# Altium schematic sheet Digital.SchDoc
size A4; SheetNumber: 2; SheetTotal: 3
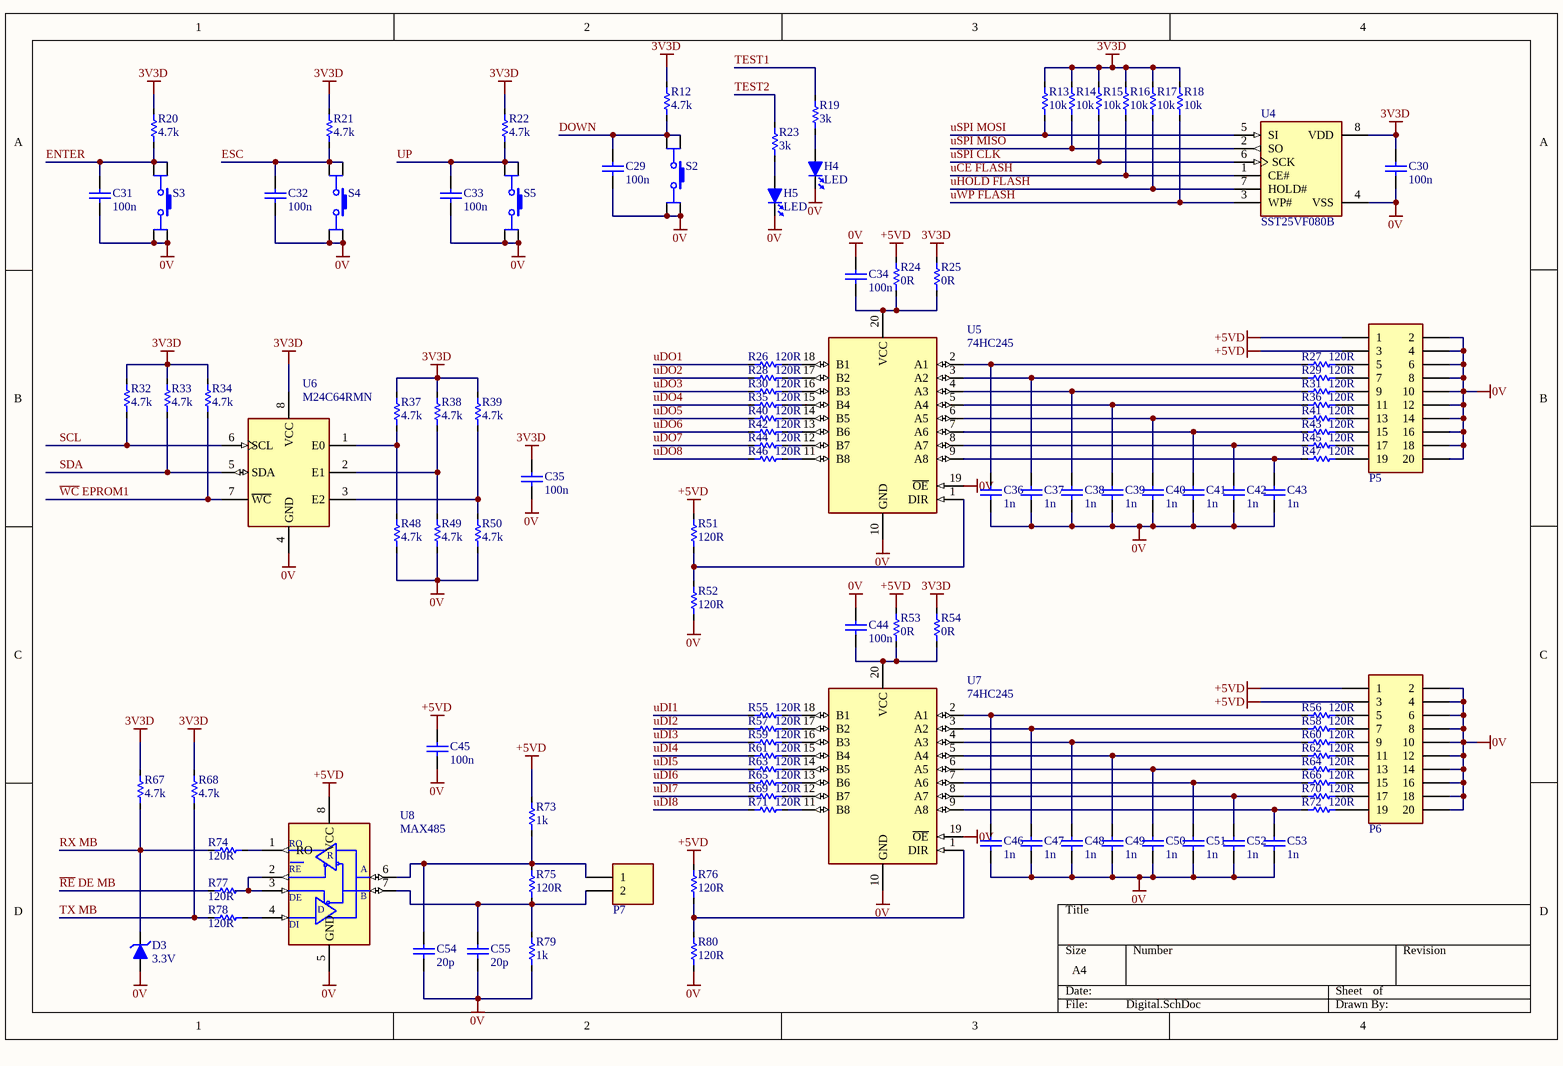
[diagram p0: Digital.SchDoc]

## Parts
C29  100n  [CC3216-1206L]
C30  100n  [CC3216-1206L]
C31  100n  [CC3216-1206L]
C32  100n  [CC3216-1206L]
C33  100n  [CC3216-1206L]
C34  100n  [CC3216-1206L]
C35  100n  [CC3216-1206L]
C36  1n  [CC3216-1206L]
C37  1n  [CC3216-1206L]
C38  1n  [CC3216-1206L]
C39  1n  [CC3216-1206L]
C40  1n  [CC3216-1206L]
C41  1n  [CC3216-1206L]
C42  1n  [CC3216-1206L]
C43  1n  [CC3216-1206L]
C44  100n  [CC3216-1206L]
C45  100n  [CC3216-1206L]
C46  1n  [CC3216-1206L]
C47  1n  [CC3216-1206L]
C48  1n  [CC3216-1206L]
C49  1n  [CC3216-1206L]
C50  1n  [CC3216-1206L]
C51  1n  [CC3216-1206L]
C52  1n  [CC3216-1206L]
C53  1n  [CC3216-1206L]
C54  20p  [CC3216-1206L]
C55  20p  [CC3216-1206L]
D3  3.3V  [SOD123]
H4  LED  [LED1206]
H5  LED  [LED1206]
P5  CONNECTOR, 2x10, 20P  [HDR_MALE_2X10_20P_2.54MM_180]  (value not drawn)
P6  CONNECTOR, 2x10, 20P  [HDR_MALE_2X10_20P_2.54MM_180]  (value not drawn)
P7  CONNECTOR, 1x2, 2P  [DS1070-2MVV6]  (value not drawn)
R12  4.7k  [CR3216-1206l]
R13  10k  [CR3216-1206l]
R14  10k  [CR3216-1206l]
R15  10k  [CR3216-1206l]
R16  10k  [CR3216-1206l]
R17  10k  [CR3216-1206l]
R18  10k  [CR3216-1206l]
R19  3k  [CR3216-1206l]
R20  4.7k  [CR3216-1206l]
R21  4.7k  [CR3216-1206l]
R22  4.7k  [CR3216-1206l]
R23  3k  [CR3216-1206l]
R24  0R  [CR3216-1206l]
R25  0R  [CR3216-1206l]
R26  120R  [CR3216-1206l]
R27  120R  [CR3216-1206l]
R28  120R  [CR3216-1206l]
R29  120R  [CR3216-1206l]
R30  120R  [CR3216-1206l]
R31  120R  [CR3216-1206l]
R32  4.7k  [CR3216-1206l]
R33  4.7k  [CR3216-1206l]
R34  4.7k  [CR3216-1206l]
R35  120R  [CR3216-1206l]
R36  120R  [CR3216-1206l]
R37  4.7k  [CR3216-1206l]
R38  4.7k  [CR3216-1206l]
R39  4.7k  [CR3216-1206l]
R40  120R  [CR3216-1206l]
R41  120R  [CR3216-1206l]
R42  120R  [CR3216-1206l]
R43  120R  [CR3216-1206l]
R44  120R  [CR3216-1206l]
R45  120R  [CR3216-1206l]
R46  120R  [CR3216-1206l]
R47  120R  [CR3216-1206l]
R48  4.7k  [CR3216-1206l]
R49  4.7k  [CR3216-1206l]
R50  4.7k  [CR3216-1206l]
R51  120R  [CR3216-1206l]
R52  120R  [CR3216-1206l]
R53  0R  [CR3216-1206l]
R54  0R  [CR3216-1206l]
R55  120R  [CR3216-1206l]
R56  120R  [CR3216-1206l]
R57  120R  [CR3216-1206l]
R58  120R  [CR3216-1206l]
R59  120R  [CR3216-1206l]
R60  120R  [CR3216-1206l]
R61  120R  [CR3216-1206l]
R62  120R  [CR3216-1206l]
R63  120R  [CR3216-1206l]
R64  120R  [CR3216-1206l]
R65  120R  [CR3216-1206l]
R66  120R  [CR3216-1206l]
R67  4.7k  [CR3216-1206l]
R68  4.7k  [CR3216-1206l]
R69  120R  [CR3216-1206l]
R70  120R  [CR3216-1206l]
R71  120R  [CR3216-1206l]
R72  120R  [CR3216-1206l]
R73  1k  [CR3216-1206l]
R74  120R  [CR3216-1206l]
R75  120R  [CR3216-1206l]
R76  120R  [CR3216-1206l]
R77  120R  [CR3216-1206l]
R78  120R  [CR3216-1206l]
R79  1k  [CR3216-1206l]
R80  120R  [CR3216-1206l]
S2  SWITCH TACT  [SWITCH TACTILE SMD 6x6 4.3mm]  (value not drawn)
S3  SWITCH TACT  [SWITCH TACTILE SMD 6x6 4.3mm]  (value not drawn)
S4  SWITCH TACT  [SWITCH TACTILE SMD 6x6 4.3mm]  (value not drawn)
S5  SWITCH TACT  [SWITCH TACTILE SMD 6x6 4.3mm]  (value not drawn)
U4  SST25VF080B  [SOIC08-S2A]
U5  74HC245  [SOIC127P1030X265-20M]
U6  M24C64RMN  [SOIC127P600X175-8N]
U7  74HC245  [SOIC127P1030X265-20M]
U8  MAX485  [SOIC127P600X175-8N]

## Nets
0V: C29.2 C30.2 C31.2 C32.2 C33.2 C34.1 C35.2 C36.2 C37.2 C38.2 C39.2 C40.2 C41.2 C42.2 C43.2 C44.1 C45.2 C46.2 C47.2 C48.2 C49.2 C50.2 C51.2 C52.2 C53.2 C54.2 C55.2 D3.1 H4.2(CATHODE) H5.2(CATHODE) P5.2 P5.4 P5.6 P5.8 P5.10 P5.12 P5.14 P5.16 P5.18 P5.20 P6.2 P6.4 P6.6 P6.8 P6.10 P6.12 P6.14 P6.16 P6.18 P6.20 R48.2 R49.2 R50.2 R52.2 R79.2 R80.2 S2.3(B) S2.4(B) S3.3(B) S3.4(B) S4.3(B) S4.4(B) S5.3(B) S5.4(B) U4.4(VSS) U5.10(GND) U5.19(~{OE}) U6.4(GND) U7.10(GND) U7.19(~{OE}) U8.5(GND)
3V3D: C30.1 C35.1 R12.1 R13.2 R14.2 R15.2 R16.2 R17.2 R18.2 R20.1 R21.1 R22.1 R25.1 R32.1 R33.1 R34.1 R37.1 R38.1 R39.1 R54.1 R67.1 R68.1 U4.8(VDD) U6.8(VCC)
+5VD: C45.1 P5.1 P5.3 P6.1 P6.3 R24.1 R51.1 R53.1 R73.1 R76.1 U8.8(VCC)
DOWN: C29.1 R12.2 S2.1(A) S2.2(A)
ENTER: C31.1 R20.2 S3.1(A) S3.2(A)
ESC: C32.1 R21.2 S4.1(A) S4.2(A)
~{RE} DE MB: R77.2
RX MB: D3.2 R67.2 R74.2
SCL: R32.2 U6.6(SCL)
SDA: R33.2 U6.5(SDA)
TEST1: R19.2
TEST2: R23.2
TX MB: R68.2 R78.2
uCE FLASH: R16.1 U4.1(CE#)
uDI1: R55.1
uDI2: R57.1
uDI3: R59.1
uDI4: R61.1
uDI5: R63.1
uDI6: R65.1
uDI7: R69.1
uDI8: R71.1
uDO1: R26.1
uDO2: R28.1
uDO3: R30.1
uDO4: R35.1
uDO5: R40.1
uDO6: R42.1
uDO7: R44.1
uDO8: R46.1
uHOLD FLASH: R17.1 U4.7(HOLD#)
UP: C33.1 R22.2 S5.1(A) S5.2(A)
uSPI CLK: R15.1 U4.6(SCK)
uSPI MISO: R14.1 U4.2(SO)
uSPI MOSI: R13.1 U4.5(SI)
uWP FLASH: R18.1 U4.3(WP#)
~{WC} EPROM1: R34.2 U6.7(~{WC})
NetC34_2: C34.2 R24.2 R25.2 U5.20(VCC)
NetC36_1: C36.1 R27.1 U5.2(A1)
NetC37_1: C37.1 R29.1 U5.3(A2)
NetC38_1: C38.1 R31.1 U5.4(A3)
NetC39_1: C39.1 R36.1 U5.5(A4)
NetC40_1: C40.1 R41.1 U5.6(A5)
NetC41_1: C41.1 R43.1 U5.7(A6)
NetC42_1: C42.1 R45.1 U5.8(A7)
NetC43_1: C43.1 R47.1 U5.9(A8)
NetC44_2: C44.2 R53.2 R54.2 U7.20(VCC)
NetC46_1: C46.1 R56.1 U7.2(A1)
NetC47_1: C47.1 R58.1 U7.3(A2)
NetC48_1: C48.1 R60.1 U7.4(A3)
NetC49_1: C49.1 R62.1 U7.5(A4)
NetC50_1: C50.1 R64.1 U7.6(A5)
NetC51_1: C51.1 R66.1 U7.7(A6)
NetC52_1: C52.1 R70.1 U7.8(A7)
NetC53_1: C53.1 R72.1 U7.9(A8)
NetC54_1: C54.1 P7.1 R73.2 R75.1 U8.6(A)
NetC55_1: C55.1 P7.2 R75.2 R79.1 U8.7(B)
NetH4_1: H4.1(ANODE) R19.1
NetH5_1: H5.1(ANODE) R23.1
NetP5_5: P5.5 R27.2
NetP5_7: P5.7 R29.2
NetP5_9: P5.9 R31.2
NetP5_11: P5.11 R36.2
NetP5_13: P5.13 R41.2
NetP5_15: P5.15 R43.2
NetP5_17: P5.17 R45.2
NetP5_19: P5.19 R47.2
NetP6_5: P6.5 R56.2
NetP6_7: P6.7 R58.2
NetP6_9: P6.9 R60.2
NetP6_11: P6.11 R62.2
NetP6_13: P6.13 R64.2
NetP6_15: P6.15 R66.2
NetP6_17: P6.17 R70.2
NetP6_19: P6.19 R72.2
NetR26_2: R26.2 U5.18(B1)
NetR28_2: R28.2 U5.17(B2)
NetR30_2: R30.2 U5.16(B3)
NetR35_2: R35.2 U5.15(B4)
NetR37_2: R37.2 R48.1 U6.1(E0)
NetR38_2: R38.2 R49.1 U6.2(E1)
NetR39_2: R39.2 R50.1 U6.3(E2)
NetR40_2: R40.2 U5.14(B5)
NetR42_2: R42.2 U5.13(B6)
NetR44_2: R44.2 U5.12(B7)
NetR46_2: R46.2 U5.11(B8)
NetR51_2: R51.2 R52.1 U5.1(DIR)
NetR55_2: R55.2 U7.18(B1)
NetR57_2: R57.2 U7.17(B2)
NetR59_2: R59.2 U7.16(B3)
NetR61_2: R61.2 U7.15(B4)
NetR63_2: R63.2 U7.14(B5)
NetR65_2: R65.2 U7.13(B6)
NetR69_2: R69.2 U7.12(B7)
NetR71_2: R71.2 U7.11(B8)
NetR74_1: R74.1 U8.1(RO)
NetR76_2: R76.2 R80.1 U7.1(DIR)
NetR77_1: R77.1 U8.2(~{RE}) U8.3(DE)
NetR78_1: R78.1 U8.4(DI)

## Notes on the sheet
- (in symbol MAX485) R; RE; D

## Library data of the parts
C29-C55 = CAPACITOR NON-POL: Capacitor; Stock Code: *; Component Type: Capacitor
D3 = DIODE ZENER: Component Type: Diode; Stock Code: *
R12-R80 = RESISTOR: Component Type: Resistor
S2-S5 = SWITCH TACT: TACT SWITCH; Stock Code: *; Component Type: Switch
U5 U7 = 74HC245: IC BUS TRANSCEIVER 8BIT 20-Pin; Stock Code: *; Component Type: IC
U8 = MAX485: ROHS-ICMAX485CSA MAXIM; Stock Code: *; Component Type: IC
H4 H5 = LED: Stock Code: *; Component Type: Diode
P5 P6 = CONNECTOR, 2x10, 20P: Component Type: Connector; Stock Code: *
P7 = CONNECTOR, 1x2, 2P: Stock Code: *; Component Type: Connector
U4 = SST25VF080B: Stock Code: *; Component Type: IC
U6 = M24C64RMN: Stock Code: *; Component Type: IC